# EAGLE design 8iSwitchesB (EAGLE 6.6.0)
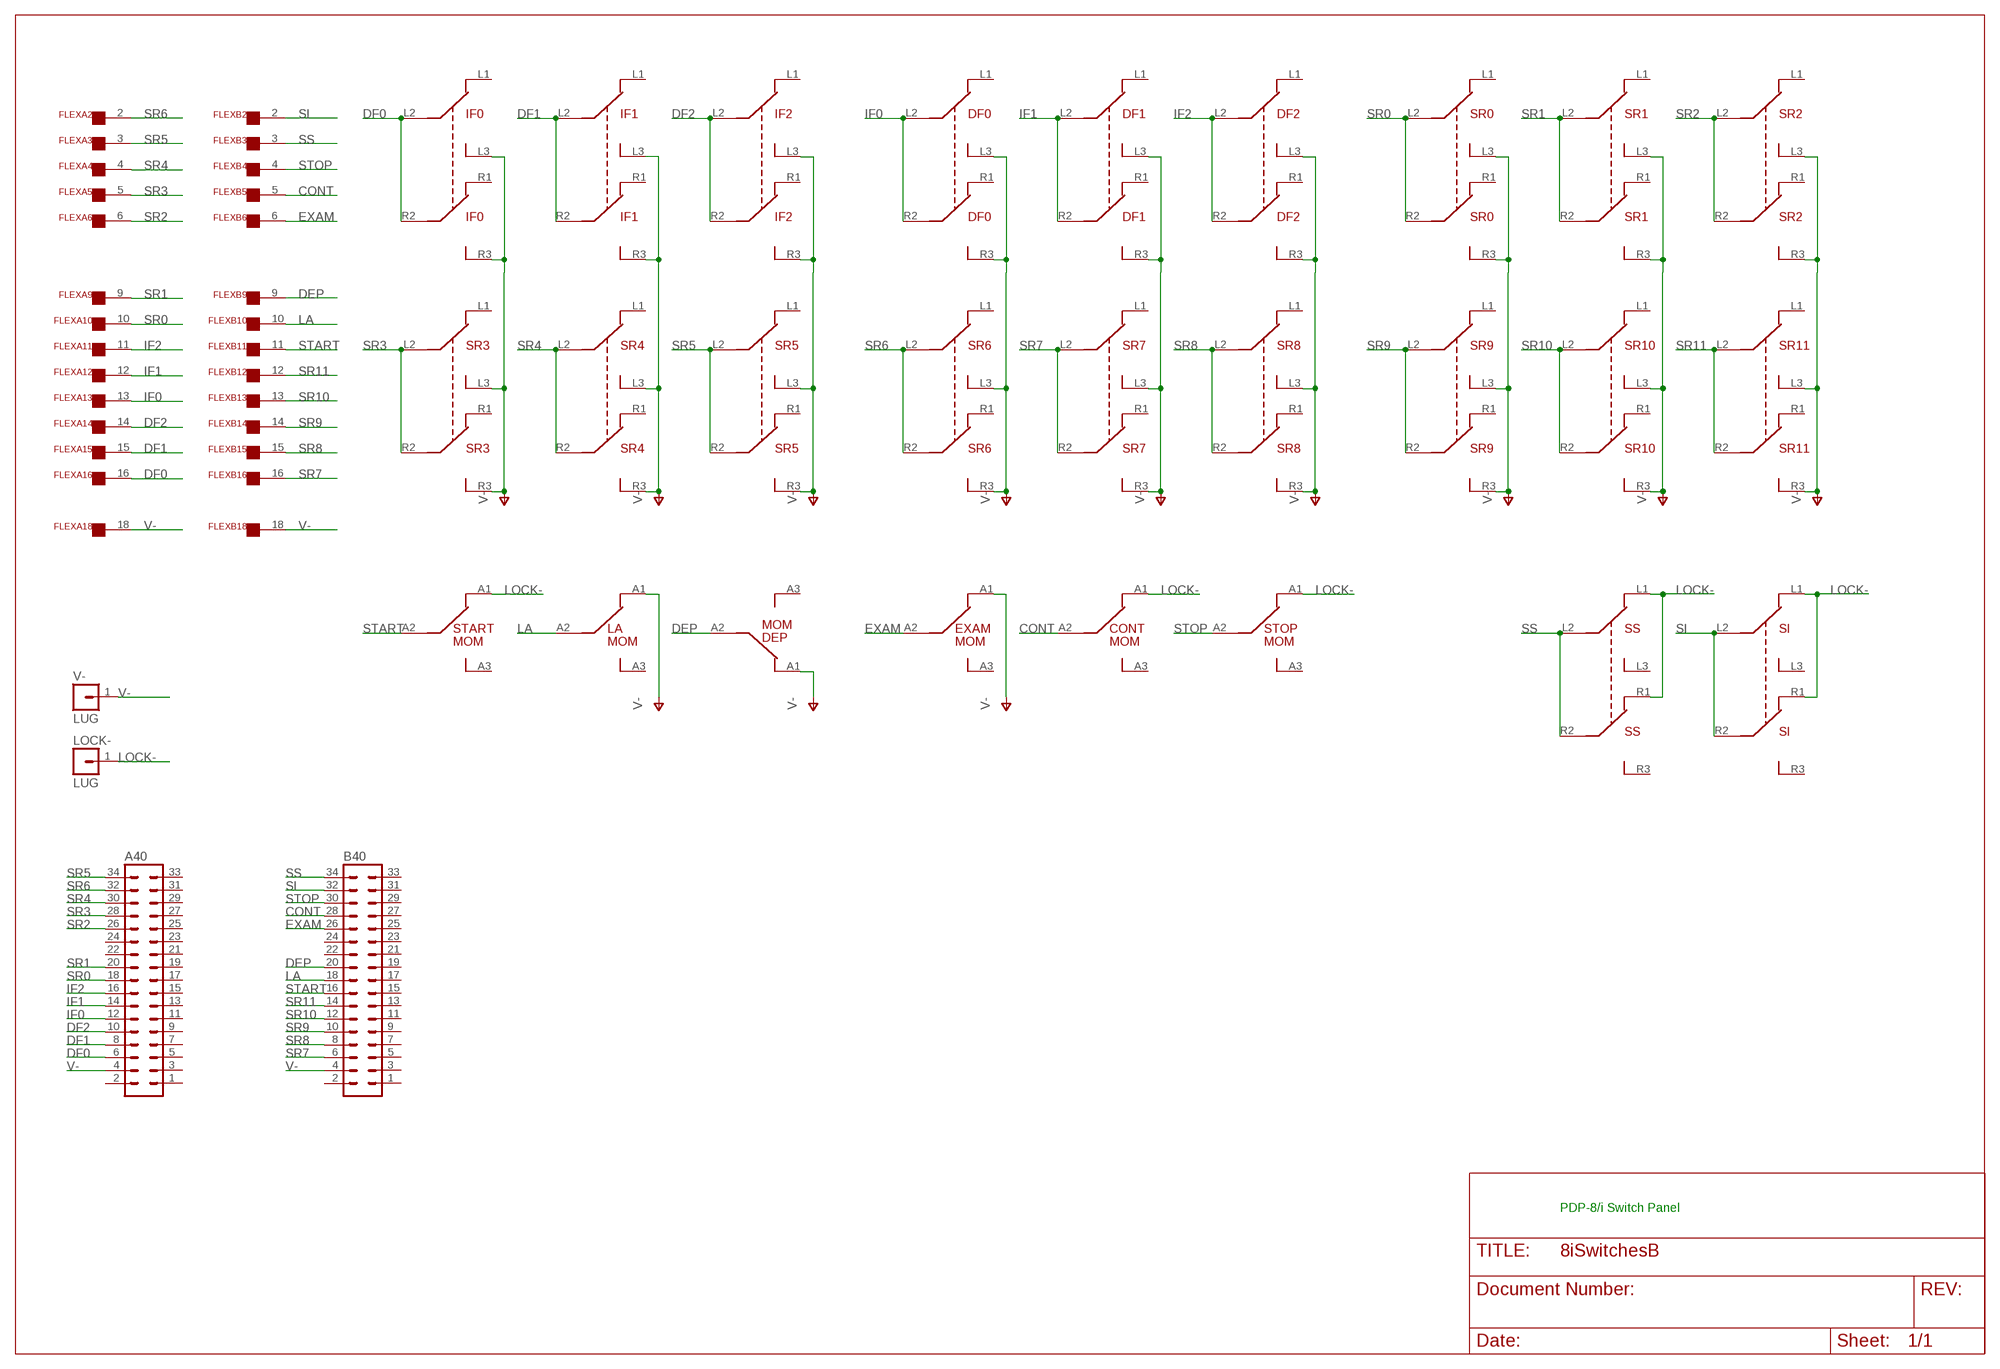
[diagram p0: schematic, sheet 1]

## Parts
A40  MA17-2  [MA17-2]
B40  MA17-2  [MA17-2]
CONT  SPDT8I  [SPDT8I]
DEP  SPDT8I  [SPDT8I]
DF0  DPDT8I  [DPDT8I]
DF1  DPDT8I  [DPDT8I]
DF2  DPDT8I  [DPDT8I]
EXAM  SPDT8I  [SPDT8I]
FLEXA  FLEX19  [FLEX19]
FLEXB  FLEX19  [FLEX19]
IF0  DPDT8I  [DPDT8I]
IF1  DPDT8I  [DPDT8I]
IF2  DPDT8I  [DPDT8I]
LA  SPDT8I  [SPDT8I]
LOCK-  LUG  [SPADELUG]
SI  DPDT8I  [DPDT8I]
SR0  DPDT8I  [DPDT8I]
SR1  DPDT8I  [DPDT8I]
SR2  DPDT8I  [DPDT8I]
SR3  DPDT8I  [DPDT8I]
SR4  DPDT8I  [DPDT8I]
SR5  DPDT8I  [DPDT8I]
SR6  DPDT8I  [DPDT8I]
SR7  DPDT8I  [DPDT8I]
SR8  DPDT8I  [DPDT8I]
SR9  DPDT8I  [DPDT8I]
SR10  DPDT8I  [DPDT8I]
SR11  DPDT8I  [DPDT8I]
SS  DPDT8I  [DPDT8I]
START  SPDT8I  [SPDT8I]
STOP  SPDT8I  [SPDT8I]
V-  LUG  [SPADELUG]

## Nets
CONT: B40.28 CONT.A2 FLEXB.5
DEP: B40.20 DEP.A2 FLEXB.9
DF0: A40.6 FLEXA.16 IF0.L2(A2) IF0.R2(B2)
DF1: A40.8 FLEXA.15 IF1.L2(A2) IF1.R2(B2)
DF2: A40.10 FLEXA.14 IF2.L2(A2) IF2.R2(B2)
EXAM: B40.26 EXAM.A2 FLEXB.6
IF0: A40.12 DF0.L2(A2) DF0.R2(B2) FLEXA.13
IF1: A40.14 DF1.L2(A2) DF1.R2(B2) FLEXA.12
IF2: A40.16 DF2.L2(A2) DF2.R2(B2) FLEXA.11
LA: B40.18 FLEXB.10 LA.A2
LOCK- [supply]: CONT.A1 LOCK-.1 SI.L1(A1) SI.R1(B1) SS.L1(A1) SS.R1(B1) START.A1 STOP.A1
SI: B40.32 FLEXB.2 SI.L2(A2) SI.R2(B2)
SR0: A40.18 FLEXA.10 SR0.L2(A2) SR0.R2(B2)
SR1: A40.20 FLEXA.9 SR1.L2(A2) SR1.R2(B2)
SR2: A40.26 FLEXA.6 SR2.L2(A2) SR2.R2(B2)
SR3: A40.28 FLEXA.5 SR3.L2(A2) SR3.R2(B2)
SR4: A40.30 FLEXA.4 SR4.L2(A2) SR4.R2(B2)
SR5: A40.34 FLEXA.3 SR5.L2(A2) SR5.R2(B2)
SR6: A40.32 FLEXA.2 SR6.L2(A2) SR6.R2(B2)
SR7: B40.6 FLEXB.16 SR7.L2(A2) SR7.R2(B2)
SR8: B40.8 FLEXB.15 SR8.L2(A2) SR8.R2(B2)
SR9: B40.10 FLEXB.14 SR9.L2(A2) SR9.R2(B2)
SR10: B40.12 FLEXB.13 SR10.L2(A2) SR10.R2(B2)
SR11: B40.14 FLEXB.12 SR11.L2(A2) SR11.R2(B2)
SS: B40.34 FLEXB.3 SS.L2(A2) SS.R2(B2)
START: B40.16 FLEXB.11 START.A2
STOP: B40.30 FLEXB.4 STOP.A2
V- [supply]: A40.4 B40.4 DEP.A1 DF0.L3(A3) DF0.R3(B3) DF1.L3(A3) DF1.R3(B3) DF2.L3(A3) DF2.R3(B3) EXAM.A1 FLEXA.18 FLEXB.18 IF0.L3(A3) IF0.R3(B3) IF1.L3(A3) IF1.R3(B3) IF2.L3(A3) IF2.R3(B3) LA.A1 SR0.L3(A3) SR0.R3(B3) SR1.L3(A3) SR1.R3(B3) SR2.L3(A3) SR2.R3(B3) SR3.L3(A3) SR3.R3(B3) SR4.L3(A3) SR4.R3(B3) SR5.L3(A3) SR5.R3(B3) SR6.L3(A3) SR6.R3(B3) SR7.L3(A3) SR7.R3(B3) SR8.L3(A3) SR8.R3(B3) SR9.L3(A3) SR9.R3(B3) SR10.L3(A3) SR10.R3(B3) SR11.L3(A3) SR11.R3(B3) V-.1
Unconnected: A40.1 A40.2 A40.3 A40.5 A40.7 A40.9 A40.11 A40.13 A40.15 A40.17 A40.19 A40.21 A40.22 A40.23 A40.24 A40.25 A40.27 A40.29 A40.31 A40.33 B40.1 B40.2 B40.3 B40.5 B40.7 B40.9 B40.11 B40.13 B40.15 B40.17 B40.19 B40.21 B40.22 B40.23 B40.24 B40.25 B40.27 B40.29 B40.31 B40.33 CONT.A3 DEP.A3 DF0.L1(A1) DF0.R1(B1) DF1.L1(A1) DF1.R1(B1) DF2.L1(A1) DF2.R1(B1) EXAM.A3 FLEXA.1 FLEXA.7 FLEXA.8 FLEXA.17 FLEXA.19 FLEXB.1 FLEXB.7 FLEXB.8 FLEXB.17 FLEXB.19 IF0.L1(A1) IF0.R1(B1) IF1.L1(A1) IF1.R1(B1) IF2.L1(A1) IF2.R1(B1) LA.A3 SI.L3(A3) SI.R3(B3) SR0.L1(A1) SR0.R1(B1) SR1.L1(A1) SR1.R1(B1) SR2.L1(A1) SR2.R1(B1) SR3.L1(A1) SR3.R1(B1) SR4.L1(A1) SR4.R1(B1) SR5.L1(A1) SR5.R1(B1) SR6.L1(A1) SR6.R1(B1) SR7.L1(A1) SR7.R1(B1) SR8.L1(A1) SR8.R1(B1) SR9.L1(A1) SR9.R1(B1) SR10.L1(A1) SR10.R1(B1) SR11.L1(A1) SR11.R1(B1) SS.L3(A3) SS.R3(B3) START.A3 STOP.A3

## Notes on the sheet
- PDP-8/i Switch Panel

## Library data of the parts
A40 B40 = con-lstb:MA17-2: PIN HEADER; OC_FARNELL: unknown; OC_NEWARK: unknown
CONT DEP EXAM LA START STOP = dec-con:SPDT8I: SPDT Momentary, as used in 8/i.
DF0 DF1 DF2 IF0 IF1 IF2 SI SR0 SR1-SR11 SS = dec-con:DPDT8I: DPDT switch as used in 8/i.
FLEXA FLEXB = dec-con:FLEX19: 19 pin Flexprint Connection
LOCK- V- = dec-con:LUG: Spade Lug

## Net classes
1 supply: width 0.762 mm

## Board
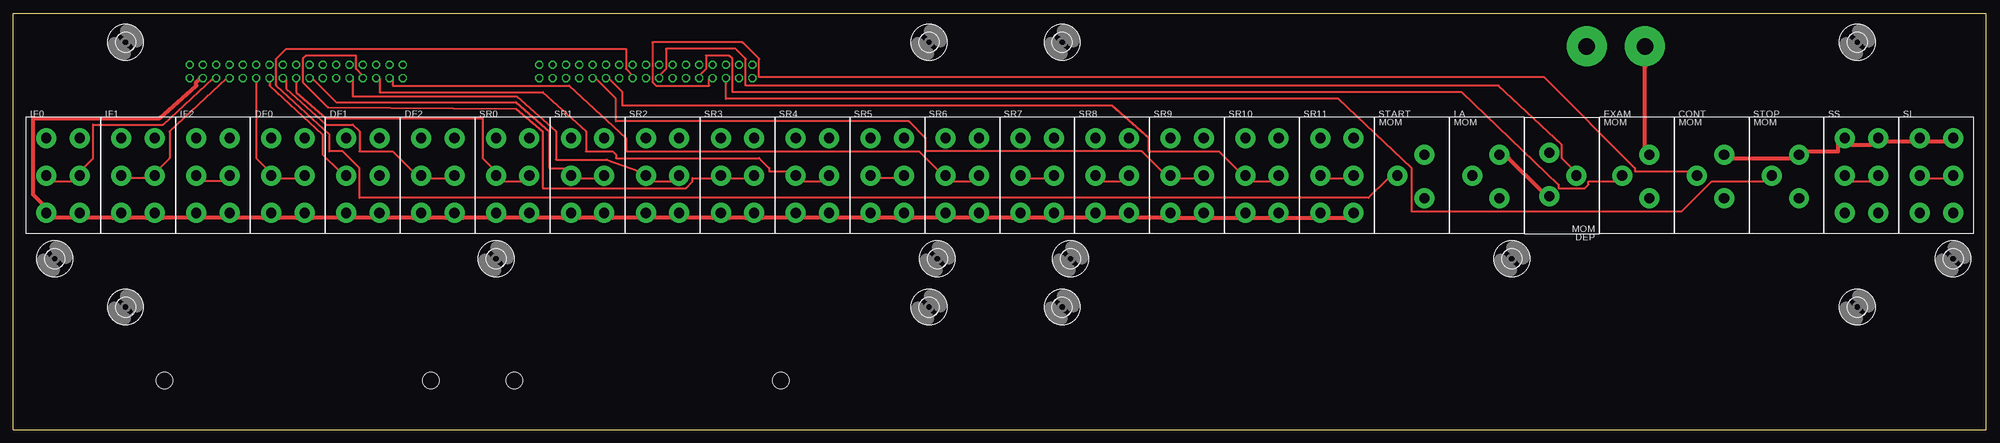
[diagram p1: board, top side]
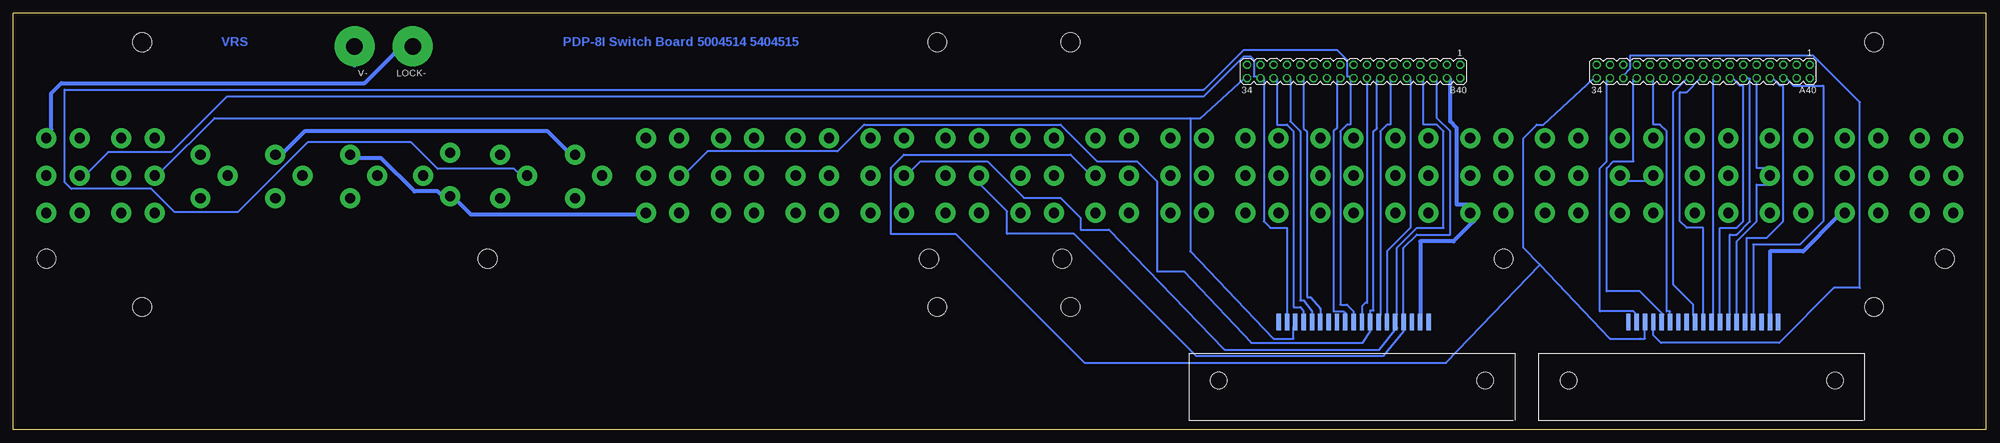
[diagram p2: board, bottom side, seen from below]

Size 376.24 x 79.37 mm. Coordinates in mm from the lower left corner, seen from the top.
Outline: 0,0 0,0
Outline: 0,0 0,0
Outline: 0,0 376.24,0 376.24,79.38 0,79.38 0,0
Copper layers (1*16): Top 0.035mm / dielectric 1.5mm / Bottom 0.035mm
Design rules "15mils": minimum track width 15mil, minimum drill 24mil, track to track 15mil, track to pad 10mil, pad to pad 10mil, via to via 10mil, smd to smd 10mil, copper to edge 25mil, drill to drill 10mil, minimum pad ring 10mil, minimum via ring 8mil, stop-mask expansion 0mil, vias tented up to drill 0mil, thermal gap 10mil

### Footprints (pad centres in the part's own frame; a part is rotated, then mirrored left to right if it is on the bottom)
MA17-2 = drill 1.016 octagon: 1 -20.32,-1.27; 2 -20.32,1.27; 3 -17.78,-1.27; 4 -17.78,1.27; 5 -15.24,-1.27; 6 -15.24,1.27; 7 -12.7,-1.27; 8 -12.7,1.27; 9 -10.16,-1.27; 10 -10.16,1.27; 11 -7.62,-1.27; 12 -7.62,1.27; 13 -5.08,-1.27; 14 -5.08,1.27; 15 -2.54,-1.27; 16 -2.54,1.27; 17 0,-1.27; 18 0,1.27; 19 2.54,-1.27; 20 2.54,1.27; 21 5.08,-1.27; 22 5.08,1.27; 23 7.62,-1.27; 24 7.62,1.27; 25 10.16,-1.27; 26 10.16,1.27; 27 12.7,-1.27; 28 12.7,1.27; 29 15.24,-1.27; 30 15.24,1.27; 31 17.78,-1.27; 32 17.78,1.27; 33 20.32,-1.27; 34 20.32,1.27
SPDT8I = drill 1.93 pad 3.81: A1 2.381,3.969; A2 -2.778,0; A3 2.381,-4.366
DPDT8I = drill 1.93 pad 3.81: L1 -3.175,7.144; L2 -3.175,0; L3 -3.175,-7.144; R1 3.175,7.144; R2 3.175,0; R3 3.175,-7.144
FLEX19 = smd 3.175 x 0.838: 1 0,14.287; 2 0,12.7; 3 0,11.113; 4 0,9.525; 5 0,7.938; 6 0,6.35; 7 0,4.763; 8 0,3.175; 9 0,1.587; 10 0,0; 11 0,-1.587; 12 0,-3.175; 13 0,-4.763; 14 0,-6.35; 15 0,-7.938; 16 0,-9.525; 17 0,-11.113; 18 0,-12.7; 19 0,-14.287
SPADELUG = drill 3.175 pad 7.62: 1 0,0
3,6 = hole 3.6: 0,0
STRAIN-RELIEF = hole 3.175: 7.62,56.515; 7.62,5.715

### Placement (x,y rotation side)
A40  53.98,68.26 180 bottom
B40  120.65,68.26 180 bottom
CONT  323.85,48.42 0 top
DEP  295.28,48.42 180 top
DF0  52.39,48.42 0 top
DF1  66.68,48.42 0 top
DF2  80.96,48.42 0 top
EXAM  309.56,48.42 0 top
FLEXA  53.98,20.48 90 bottom
FLEXB  120.65,20.48 90 bottom
IF0  9.53,48.42 0 top
IF1  23.81,48.42 0 top
IF2  38.1,48.42 0 top
LA  280.99,48.42 0 top
LOCK-  300.04,73.02 180 bottom
SI  366.71,48.42 0 top
SR0  95.25,48.42 0 top
SR1  109.54,48.42 0 top
SR2  123.83,48.42 0 top
SR3  138.11,48.42 0 top
SR4  152.4,48.42 0 top
SR5  166.69,48.42 0 top
SR6  180.98,48.42 0 top
SR7  195.26,48.42 0 top
SR8  209.55,48.42 0 top
SR9  223.84,48.42 0 top
SR10  238.13,48.42 0 top
SR11  252.41,48.42 0 top
SS  352.43,48.42 0 top
START  266.7,48.42 0 top
STOP  338.14,48.42 0 top
U$1  [3,6]  201.61,32.54 0 top
U$2  [3,6]  200.03,23.34 0 top
U$3  [3,6]  285.75,32.54 0 top
U$4  [3,6]  200.03,73.82 0 top
U$5  [3,6]  351.63,73.82 0 top
U$6  [3,6]  369.89,32.54 0 top
U$7  [3,6]  351.63,23.34 0 top
U$10  [3,6]  176.21,32.54 0 top
U$11  [3,6]  174.63,23.34 0 top
U$12  [3,6]  174.63,73.82 0 top
U$13  [3,6]  21.43,73.82 0 top
U$14  [3,6]  21.43,23.34 0 top
U$15  [3,6]  7.94,32.54 0 top
U$16  [3,6]  92.08,32.54 0 top
U$17  [STRAIN-RELIEF]  89.85,1.75 90 bottom
U$18  [STRAIN-RELIEF]  23.18,1.75 90 bottom
V-  311.15,73.02 180 bottom

### Tracks (layer width: path | path; a pad name or v marks a point on that pad's centre or on a via)
CONT
  Top 0.381: CONT.A2 319.41,49.21 309.25,49.21 309.25,49.85 291.94,67.15 142.24,67.15 142.24,70.64 139.07,73.82 121.92,73.82 121.92,66.2 122.56,65.56 132.72,65.56 132.72,66.83 B40.28
  Bottom 0.381: B40.28 132.72,66.83 132.72,58.74 130.81,56.83 130.81,24.61 130.18,24.61 128.59,22.54 FLEXB.5
DEP
  Top 0.381: DEP.A2 297.18,49.85 295.28,51.75 295.28,54.29 283.21,65.56 139.7,65.56 139.7,70.64 137.8,72.55 124.46,72.55 124.46,68.74 123.19,67.47 B40.20
  Bottom 0.381: B40.20 123.83,66.83 123.83,57.47 124.46,56.83 124.46,22.54 122.56,22.54 122.24,22.23 FLEXB.9
DF0
  Top 0.381: A40.6 38.1,66.83 28.58,58.1 15.24,58.1 15.24,51.75 13.34,49.85 IF0.R2 11.43,47.31 7.62,47.31 IF0.L2
  Bottom 0.381: FLEXA.16 44.45,21.91 44.45,35.24 35.56,35.24 31.12,39.69 31.12,65.56 36.83,65.56 38.1,66.83 A40.6
DF1
  Top 0.381: A40.8 40.64,66.83 29.85,56.83 29.85,51.75 27.94,49.85 IF1.R2 25.4,47.94 22.23,47.94 IF1.L2
  Bottom 0.381: FLEXA.15 45.72,21.91 45.72,36.51 41.91,36.51 38.74,39.69 38.74,65.56 39.37,65.56 40.64,66.83 A40.8
DF2
  Top 0.381: IF2.L2 36.2,47.31 40.01,47.31 IF2.R2
  Bottom 0.381: A40.10 43.82,66.83 43.82,49.85 41.91,49.85 IF2.R2 41.91,46.67 43.82,46.67 43.82,39.69 47.63,35.88 47.63,21.91 FLEXA.14
EXAM
  Top 0.381: EXAM.A2 305.44,47.31 300.36,47.31 300.36,46.67 299.72,46.04 294.64,46.04 294.64,46.67 276.23,64.29 137.16,64.29 137.16,70.64 136.53,71.28 132.08,71.28 132.08,68.74 130.81,67.47 B40.26
  Bottom 0.381: B40.26 130.18,66.83 130.18,57.47 129.54,56.83 129.54,25.24 128.91,25.24 127,23.02 127,21.91 FLEXB.6
IF0
  Top 0.381: A40.12 46.36,66.83 46.36,51.75 48.26,49.85 DF0.L2 50.8,47.94 53.98,47.94 DF0.R2
  Bottom 0.381: FLEXA.13 48.9,21.91 48.9,37.15 47.63,37.15 45.09,39.69 45.09,66.83 45.72,66.83 A40.12
IF1
  Top 0.381: A40.14 48.9,66.83 48.9,65.56 59.06,56.2 59.06,52.39 62.23,49.21 DF1.L2
  Bottom 0.381: FLEXA.12 50.8,21.91 50.8,38.42 47.63,38.42 46.36,39.69 46.36,65.56 46.99,65.56 48.26,66.83 A40.14 | DF1.R2 68.58,47.31 64.77,47.31 DF1.L2
IF2
  Top 0.381: DF2.R2 82.55,47.94 79.38,47.94 DF2.L2 76.2,49.21 72.39,53.02 66.04,53.02 66.04,56.83 64.77,58.1 59.69,58.1 52.07,64.93 52.07,66.83 A40.16
  Bottom 0.381: A40.16 52.07,66.83 52.07,21.91 FLEXA.11
LA
  Bottom 0.381: FLEXB.10 120.65,21.91 120.65,22.54 121.92,23.81 123.19,23.81 123.19,56.83 121.92,58.1 121.29,58.1 121.29,66.83 B40.18 121.29,67.31 121.92,67.31 121.92,70.48 123.83,72.39 141.61,72.39 149.23,64.77 366.4,64.77 366.4,47.15 365.13,45.88 349.89,45.88 345.44,41.43 333.38,41.43 320.04,54.77 300.36,54.77 295.28,49.69 280.67,49.69 280.04,49.05 LA.A2
LOCK-
  Top 0.762: SI.R1 368.3,54.93 365.13,54.93 SI.L1 361.95,54.93 356.87,54.93 SS.R1 354.33,54.29 350.52,54.29 SS.L1 347.98,54.29 347.98,53.02 342.27,53.02 STOP.A1 339.09,51.75 327.66,51.75 CONT.A1
  Bottom 0.762: START.A1 270.51,53.02 274.32,56.83 320.68,56.83 324.49,53.02 CONT.A1 | LOCK-.1 303.53,71.75 309.25,66.04 367.03,66.04 368.94,64.14 368.94,57.15 SI.R1
SI
  Top 0.381: SI.L2 365.13,47.94 368.3,47.94 SI.R2
  Bottom 0.381: FLEXB.2 133.35,21.91 133.35,38.42 136.53,38.42 137.8,39.69 137.8,66.83 B40.32 139.07,67.31 139.7,67.31 139.7,70.48 140.34,71.12 141.61,71.12 149.23,63.5 335.44,63.5 346.08,52.86 358.14,52.86 361.95,49.05 SI.L2
SR0
  Top 0.381: A40.18 53.98,66.83 53.98,64.29 59.69,59.37 89.54,59.37 89.54,51.75 91.44,49.85 SR0.L2 93.35,47.31 97.16,47.31 SR0.R2
  Bottom 0.381: FLEXA.10 53.98,21.91 53.98,38.42 57.15,38.42 58.42,39.69 58.42,64.29 57.15,64.29 54.61,66.83 A40.18
SR1
  Top 0.381: SR1.R2 111.13,47.94 107.95,47.94 SR1.L2 105.41,49.85 102.24,49.85 102.24,56.83 95.89,62.39 61.6,62.39 57.15,66.83 A40.20
  Bottom 0.381: A40.20 57.15,66.83 59.69,64.29 59.69,27.62 55.88,23.81 55.88,21.91 FLEXA.9
SR2
  Top 0.381: SR2.R2 125.73,47.31 121.92,47.31 SR2.L2 119.38,49.21 113.19,51.44 103.51,51.44 103.51,56.83 96.04,63.5 64.77,63.5 64.77,66.83 A40.26
  Bottom 0.381: A40.26 63.5,66.83 63.5,58.1 62.23,58.1 60.96,56.83 60.96,22.54 60.33,22.54 60.33,21.91 FLEXA.6
SR3
  Top 0.381: SR3.R2 139.7,47.94 136.53,47.94 SR3.L2 133.35,47.94 129.54,47.94 129.54,47.31 128.27,46.04 100.97,46.04 100.97,56.83 95.89,61.12 60.01,61.44 55.25,66.2 55.25,70.64 55.88,71.28 65.41,71.28 65.41,68.74 66.68,67.47 A40.28
  Bottom 0.381: A40.28 67.31,66.83 67.31,51.12 71.12,51.12 72.39,49.85 72.39,26.35 66.04,26.35 61.6,21.91 FLEXA.5
SR4
  Top 0.381: SR4.R2 154.31,47.31 150.5,47.31 SR4.L2 147.96,49.21 144.15,49.21 144.15,49.85 142.24,51.75 114.94,51.75 114.94,52.39 114.3,53.02 109.22,53.02 109.22,56.83 100.97,64.29 69.85,64.29 69.85,66.83 A40.30
  Bottom 0.381: A40.30 69.22,67.47 67.95,68.74 67.95,71.28 33.02,71.28 24.13,62.39 24.13,26.99 29.05,26.99 39.53,16.51 62.07,16.51 63.5,17.94 63.5,19.37 FLEXA.4
SR5
  Top 0.381: SR5.L2 165.1,47.94 168.28,47.94 SR5.R2
  Bottom 0.381: 85.09,31.43 71.76,17.3 66.04,17.3 65.09,17.3 FLEXA.3 | 85.09,31.43 88.27,34.61 88.27,55.56 85.73,58.1 84.46,58.1 74.93,66.83 A40.34 | 85.09,31.43 103.03,12.7 171.93,12.7 196.53,37.31 208.92,37.31 208.92,49.85 206.38,52.39 174.63,52.39 171.45,49.21 SR5.R2
SR6
  Top 0.381: SR6.R2 182.88,47.31 179.07,47.31 SR6.L2 176.53,49.21 172.72,53.02 116.84,53.02 116.84,55.56 106.05,65.56 72.39,65.56 72.39,66.83 A40.32
  Bottom 0.381: A40.32 72.39,66.83 72.39,51.12 73.66,49.85 73.66,22.54 67.31,22.54 66.68,21.91 FLEXA.2
SR7
  Top 0.381: SR7.L2 193.68,47.94 196.85,47.94 SR7.R2
  Bottom 0.381: B40.6 104.78,66.83 104.78,59.37 102.24,56.83 102.24,37.15 108.59,37.15 111.13,34.61 111.13,21.91 FLEXB.16 111.13,19.37 111.13,18.73 115.09,13.97 150.65,13.97 173.99,37.31 186.69,37.31 186.69,41.59 191.77,46.67 SR7.L2
SR8
  Top 0.381: SR8.L2 207.65,47.31 211.46,47.31 SR8.R2
  Bottom 0.381: B40.8 107.32,66.83 107.32,58.1 104.78,58.1 103.51,56.83 103.51,38.42 108.59,38.42 112.4,34.61 112.4,21.91 FLEXB.15 112.4,19.37 115.73,15.24 145.26,15.24 167.32,38.1 172.72,38.1 172.72,40.32 176.53,44.13 183.52,44.13 190.5,51.12 203.2,51.12 205.11,49.21 SR8.L2
SR9
  Top 0.381: SR9.R2 225.43,47.94 222.25,47.94 SR9.L2 219.08,49.21 215.27,53.02 173.99,53.02 173.99,55.56 170.82,58.74 114.94,58.74 114.94,63.02 111.13,66.83 B40.10
  Bottom 0.381: B40.10 109.86,66.83 109.86,38.42 114.3,33.97 114.3,21.91 FLEXB.14
SR10
  Top 0.381: SR10.R2 240.03,47.31 236.22,47.31 SR10.L2 233.68,49.21 229.87,53.02 216.54,53.02 216.54,55.56 209.55,61.75 116.21,61.75 116.21,64.29 113.67,66.83 B40.12
  Bottom 0.381: B40.12 113.67,66.83 113.67,58.1 114.3,58.1 115.57,56.83 115.57,21.91 FLEXB.13
SR11
  Top 0.381: SR11.L2 250.83,47.94 254,47.94 SR11.R2
  Bottom 0.381: B40.14 116.21,66.83 116.21,57.47 116.84,56.83 116.84,22.7 117.48,22.7 FLEXB.12 117.48,19.37 117.48,18.73 118.9,16.51 140.18,16.51 153.04,30.16 158.12,30.16 158.12,47.31 161.93,51.12 169.55,51.12 176.53,58.1 214,58.1 219.08,53.02 243.84,53.02 247.65,49.21 SR11.L2
SS
  Top 0.381: SS.R2 354.33,47.31 350.52,47.31 SS.L2
  Bottom 0.381: 151.77,59.37 337.82,59.37 347.98,49.21 SS.L2 | 151.77,59.37 149.86,59.37 141.61,66.83 B40.34 | 151.77,59.37 151.77,33.97 135.89,17.3 132.08,17.3 132.08,19.37 FLEXB.3
START
  Top 0.381: START.A2 262.26,47.94 258.45,44.13 66.04,44.13 66.04,49.85 62.87,53.02 60.33,53.02 60.33,56.2 50.17,65.56 50.17,70.64 52.07,72.55 116.84,72.55 116.84,68.74 118.11,67.47 B40.16
  Bottom 0.381: B40.16 118.11,66.83 118.11,24.13 118.43,24.13 119.06,23.5 FLEXB.11
STOP
  Top 0.381: STOP.A2 334.01,47.31 323.85,47.31 318.14,41.59 266.7,41.59 266.7,49.85 252.73,63.02 135.89,63.02 135.89,66.83 B40.30
  Bottom 0.381: B40.30 135.26,66.83 135.26,58.1 133.35,58.1 132.08,56.83 132.08,23.34 130.81,23.34 130.18,22.54 FLEXB.4
V-
  Top 0.762: A40.4 35.56,66.83 34.93,66.2 34.93,65.56 27.94,59.37 3.81,59.37 3.81,44.77 5.72,42.86 IF0.L3 7.62,40.32 11.43,40.32 IF0.R3 13.97,40.32 19.05,40.32 IF1.L3 22.23,40.32 25.4,40.32 IF1.R3 28.58,40.32 33.66,40.32 IF2.L3 36.2,40.32 40.01,40.32 IF2.R3 42.55,40.32 47.63,40.32 DF0.L3 50.8,40.32 53.98,40.32 DF0.R3 57.15,40.32 62.23,40.32 DF1.L3 64.77,40.32 68.58,40.32 DF1.R3 71.12,40.32 76.2,40.32 DF2.L3 79.38,40.32 82.55,40.32 DF2.R3 85.73,40.32 90.81,40.32 SR0.L3 93.35,40.32 97.16,40.32 SR0.R3 99.7,40.32 104.78,40.32 SR1.L3 107.95,40.32 111.13,40.32 SR1.R3 114.3,40.32 119.38,40.32 SR2.L3 121.92,40.32 125.73,40.32 SR2.R3 128.27,40.32 133.35,40.32 SR3.L3 136.53,40.32 139.7,40.32 SR3.R3 142.88,40.32 147.96,40.32 SR4.L3 150.5,40.32 154.31,40.32 SR4.R3 156.85,40.32 161.93,40.32 SR5.L3 165.1,40.32 168.28,40.32 SR5.R3 171.45,40.32 176.53,40.32 SR6.L3 179.07,40.32 182.88,40.32 SR6.R3 185.42,40.32 190.5,40.32 SR7.L3 193.68,40.32 196.85,40.32 SR7.R3 200.03,40.32 205.11,40.32 SR8.L3 207.65,40.32 211.46,40.32 SR8.R3 214,40.32 219.08,40.32 SR9.L3 222.25,40.32 225.43,40.32 SR9.R3 228.6,40.32 233.68,40.32 SR10.L3 236.22,40.32 240.03,40.32 SR10.R3 242.57,40.32 247.65,40.32 SR11.L3 250.83,40.32 254,40.32 SR11.R3 | DEP.A1 291.47,45.4 285.12,51.75 LA.A1 | 311.15,69.22 311.15,53.66 EXAM.A1 | 311.15,69.22 311.15,69.37 | 311.15,69.22 V-.1
  Bottom 0.762: FLEXA.18 41.28,21.91 41.28,33.97 34.93,33.97 28.58,40.32 IF1.R3 | V-.1 311.15,69.37 | EXAM.A1 310.52,51.75 306.07,51.75 299.72,45.4 295.28,45.4 294.64,44.77 DEP.A1 291.47,43.5 288.93,40.96 257.18,40.96 SR11.R3 | B40.4 102.24,66.83 102.24,58.74 100.97,57.47 100.97,42.86 99.06,42.86 SR0.R3 97.79,39.69 101.6,35.88 107.95,35.88 107.95,21.91 FLEXB.18

### Text on the board
Bottom: PDP-8I Switch Board 5004514 5404515 | VRS